# Altium schematic sheet DONUt_toplevel.SchDoc
size A
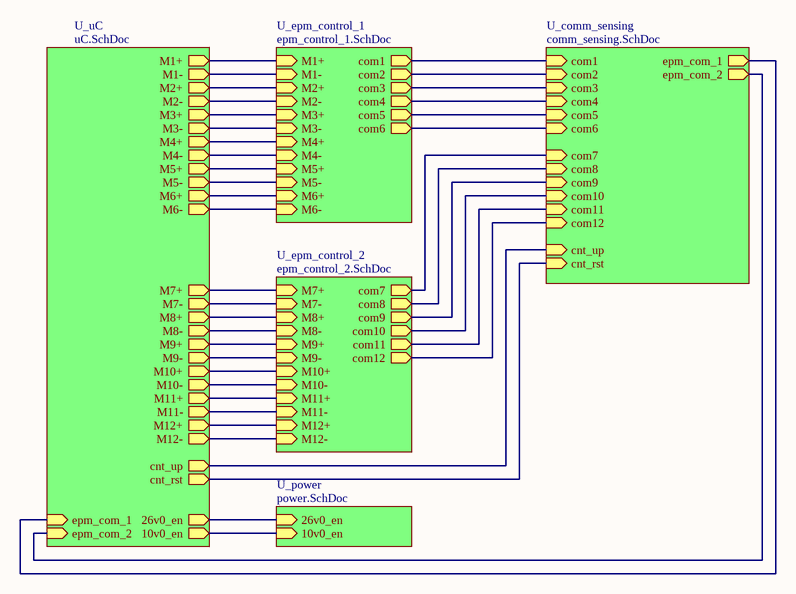
[diagram p0: DONUt_toplevel.SchDoc]

## Sub-sheets
U_comm_sensing = comm_sensing.SchDoc: com1 (in), com2 (in), com3 (in), com4 (in), com5 (in), com6 (in), com7 (in), com8 (in), com9 (in), com10 (in), com11 (in), com12 (in), cnt_rst (in), cnt_up (in), epm_com_1 (out), epm_com_2 (out)
U_epm_control_1 = epm_control_1.SchDoc: M1+ (in), M1- (in), M2+ (in), M2- (in), com1 (out), com2 (out), com3 (out), com4 (out), com5 (out), com6 (out), M3+ (in), M3- (in), M4+ (in), M4- (in), M5+ (in), M5- (in), M6+ (in), M6- (in)
U_epm_control_2 = epm_control_2.SchDoc: com7 (out), com8 (out), com9 (out), com10 (out), com11 (out), com12 (out), M7+ (in), M7- (in), M8+ (in), M8- (in), M9+ (in), M9- (in), M10+ (in), M10- (in), M11+ (in), M11- (in), M12+ (in), M12- (in)
U_power = power.SchDoc: 26v0_en (in), 10v0_en (in)
U_uC = uC.SchDoc: M4- (out), M4+ (out), M3- (out), M3+ (out), M8- (out), M9+ (out), M9- (out), M10+ (out), M6- (out), M7+ (out), M7- (out), M8+ (out), M2- (out), M2+ (out), M1- (out), M1+ (out), M5- (out), M6+ (out), M5+ (out), M10- (out), M11+ (out), M11- (out), M12+ (out), M12- (out), 10v0_en (out), 26v0_en (out), cnt_up (out), cnt_rst (out), epm_com_2 (in), epm_com_1 (in)

## Nets
(unnamed): sheet U_power/26v0_en, sheet U_uC/26v0_en
(unnamed): sheet U_power/10v0_en, sheet U_uC/10v0_en
(unnamed): sheet U_comm_sensing/com1, sheet U_epm_control_1/com1
(unnamed): sheet U_comm_sensing/com2, sheet U_epm_control_1/com2
(unnamed): sheet U_comm_sensing/com3, sheet U_epm_control_1/com3
(unnamed): sheet U_comm_sensing/com4, sheet U_epm_control_1/com4
(unnamed): sheet U_comm_sensing/com5, sheet U_epm_control_1/com5
(unnamed): sheet U_comm_sensing/com6, sheet U_epm_control_1/com6
(unnamed): sheet U_comm_sensing/com7, sheet U_epm_control_2/com7
(unnamed): sheet U_comm_sensing/com8, sheet U_epm_control_2/com8
(unnamed): sheet U_comm_sensing/com9, sheet U_epm_control_2/com9
(unnamed): sheet U_comm_sensing/com10, sheet U_epm_control_2/com10
(unnamed): sheet U_comm_sensing/com11, sheet U_epm_control_2/com11
(unnamed): sheet U_comm_sensing/com12, sheet U_epm_control_2/com12
(unnamed): sheet U_comm_sensing/cnt_rst, sheet U_uC/cnt_rst
(unnamed): sheet U_comm_sensing/cnt_up, sheet U_uC/cnt_up
(unnamed): sheet U_comm_sensing/epm_com_1, sheet U_uC/epm_com_1
(unnamed): sheet U_comm_sensing/epm_com_2, sheet U_uC/epm_com_2
(unnamed): sheet U_uC/M4-, sheet U_epm_control_1/M4-
(unnamed): sheet U_uC/M4+, sheet U_epm_control_1/M4+
(unnamed): sheet U_uC/M3-, sheet U_epm_control_1/M3-
(unnamed): sheet U_uC/M3+, sheet U_epm_control_1/M3+
(unnamed): sheet U_uC/M8-, sheet U_epm_control_2/M8-
(unnamed): sheet U_uC/M9+, sheet U_epm_control_2/M9+
(unnamed): sheet U_uC/M9-, sheet U_epm_control_2/M9-
(unnamed): sheet U_uC/M10+, sheet U_epm_control_2/M10+
(unnamed): sheet U_uC/M6-, sheet U_epm_control_1/M6-
(unnamed): sheet U_uC/M7+, sheet U_epm_control_2/M7+
(unnamed): sheet U_uC/M7-, sheet U_epm_control_2/M7-
(unnamed): sheet U_uC/M8+, sheet U_epm_control_2/M8+
(unnamed): sheet U_uC/M2-, sheet U_epm_control_1/M2-
(unnamed): sheet U_uC/M2+, sheet U_epm_control_1/M2+
(unnamed): sheet U_uC/M1-, sheet U_epm_control_1/M1-
(unnamed): sheet U_uC/M1+, sheet U_epm_control_1/M1+
(unnamed): sheet U_uC/M5-, sheet U_epm_control_1/M5-
(unnamed): sheet U_uC/M6+, sheet U_epm_control_1/M6+
(unnamed): sheet U_uC/M5+, sheet U_epm_control_1/M5+
(unnamed): sheet U_uC/M10-, sheet U_epm_control_2/M10-
(unnamed): sheet U_uC/M11+, sheet U_epm_control_2/M11+
(unnamed): sheet U_uC/M11-, sheet U_epm_control_2/M11-
(unnamed): sheet U_uC/M12+, sheet U_epm_control_2/M12+
(unnamed): sheet U_uC/M12-, sheet U_epm_control_2/M12-